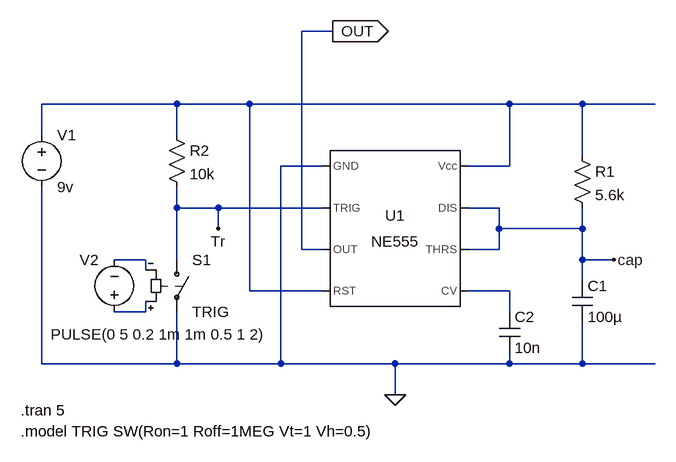
[diagram p0: schematic electronics_555_monostable_1utf.asc]
electronics_555_monostable_1utf.asc, the LTspice schematic file:
Version 4
SHEET 1 880 680
WIRE 112 -128 64 -128
WIRE -128 -16 -336 -16
WIRE -16 -16 -128 -16
WIRE 384 -16 -16 -16
WIRE 496 -16 384 -16
WIRE 608 -16 496 -16
WIRE -336 32 -336 -16
WIRE -128 32 -128 -16
WIRE 496 64 496 -16
WIRE 96 80 32 80
WIRE 384 80 384 -16
WIRE 384 80 320 80
WIRE -128 144 -128 112
WIRE -64 144 -128 144
WIRE 96 144 -64 144
WIRE 368 144 320 144
WIRE -64 176 -64 144
WIRE 368 176 368 144
WIRE 496 176 496 144
WIRE 496 176 368 176
WIRE 64 208 64 -128
WIRE 96 208 64 208
WIRE 368 208 368 176
WIRE 368 208 320 208
WIRE -176 224 -224 224
WIRE -128 224 -128 144
WIRE 496 224 496 176
WIRE 544 224 496 224
WIRE -176 240 -176 224
WIRE 496 256 496 224
WIRE -16 272 -16 -16
WIRE 96 272 -16 272
WIRE 384 272 320 272
WIRE -176 304 -176 288
WIRE -176 304 -224 304
WIRE 384 304 384 272
WIRE -336 384 -336 112
WIRE -128 384 -128 304
WIRE -128 384 -336 384
WIRE 32 384 32 80
WIRE 32 384 -128 384
WIRE 208 384 32 384
WIRE 384 384 384 368
WIRE 384 384 208 384
WIRE 496 384 496 320
WIRE 496 384 384 384
WIRE 608 384 496 384
WIRE 208 432 208 384
FLAG 208 432 0
FLAG 112 -128 OUT
IOPIN 112 -128 Out
FLAG -64 176 Tr
FLAG 544 224 cap
SYMBOL Misc\\NE555 208 176 R0
SYMATTR InstName U1
SYMBOL voltage -336 16 R0
WINDOW 123 0 0 Left 0
WINDOW 39 0 0 Left 0
SYMATTR InstName V1
SYMATTR Value 9v
SYMBOL res 480 48 R0
SYMATTR InstName R1
SYMATTR Value 5.6k
SYMBOL cap 480 256 R0
SYMATTR InstName C1
SYMATTR Value 100µ
SYMBOL cap 368 304 R0
SYMATTR InstName C2
SYMATTR Value 10n
SYMBOL sw -128 208 R0
SYMATTR InstName S1
SYMATTR Value TRIG
SYMBOL res -144 16 R0
SYMATTR InstName R2
SYMATTR Value 10k
SYMBOL voltage -224 320 R180
WINDOW 0 24 96 Left 2
WINDOW 3 -233 -19 Left 2
WINDOW 123 0 0 Left 0
WINDOW 39 0 0 Left 0
SYMATTR InstName V2
SYMATTR Value PULSE(0 5 0.2 1m 1m 0.5 1 2)
TEXT -368 456 Left 2 !.tran 5
TEXT -368 488 Left 2 !.model TRIG SW(Ron=1 Roff=1MEG Vt=1 Vh=0.5)

The netlist it stands for:
* electronics_555_monostable_1utf.asc
XU1 0 Tr OUT N001 N003 cap cap N001 NE555  ; pins GND TRIG OUT RST CV THRS DIS Vcc
V1 N001 0 9v
R1 N001 cap 5.6k
C1 cap 0 100µ
C2 N003 0 10n
S1 Tr 0 N004 N002 TRIG
R2 N001 Tr 10k
V2 N004 N002 PULSE(0 5 0.2 1m 1m 0.5 1 2)
.tran 5
.model TRIG SW(Ron=1 Roff=1MEG Vt=1 Vh=0.5)
.lib NE555.sub
.backanno
.end